# Altium schematic sheet DE-290817_03.SchDoc: Mifare Reader Writer
size A4; Author: eldar6776@hotmail.com; DrawnBy: Eldar Dedić; Organization: I-MEDIA GROUP d.o.o.; Address1: Topal Osman Paše 18; Address2: 71000 Sarajevo; Address3: Federacija BiH; Address4: Bosna i Hercegovina; Revision: 001; DocumentName: DE-290817; ProjectName: Hotel Room Access Controller Unit
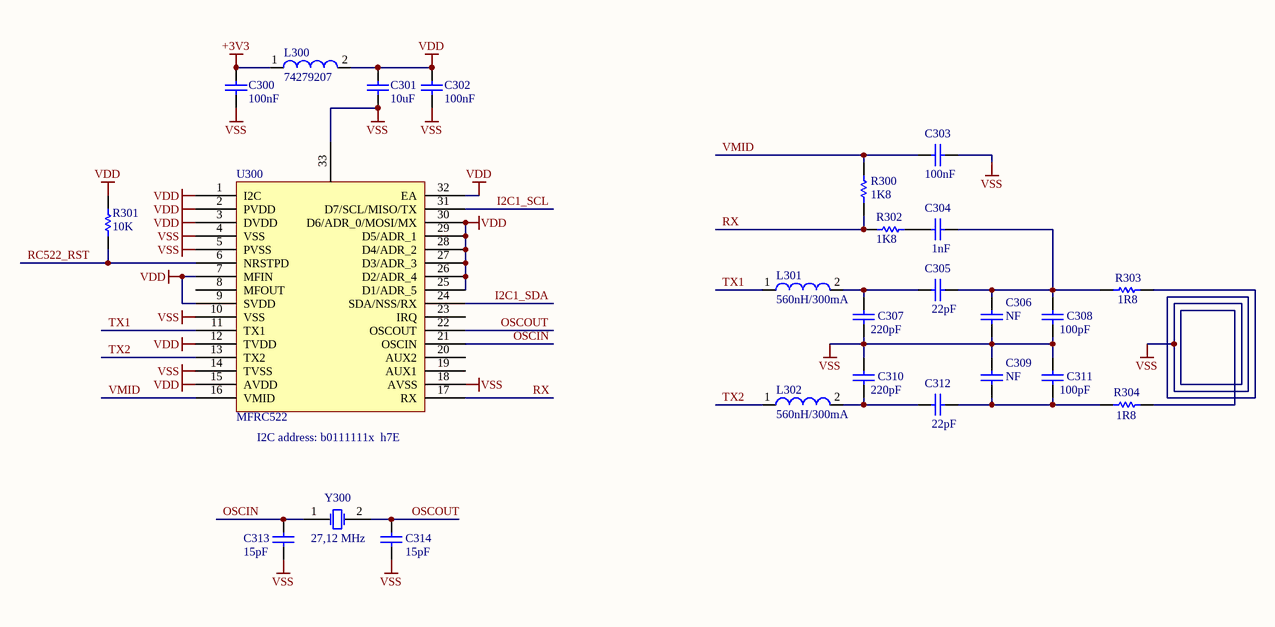
[diagram p0: DE-290817_03.SchDoc]

## Parts
C300  100nF  [0603]
C301  10uF  [0805]
C302  100nF  [0603]
C303  100nF  [0603]
C304  1nF  [0603]
C305  22pF  [0603]
C306  NF  [0603]
C307  220pF  [0603]
C308  100pF  [0603]
C309  NF  [0603]
C310  220pF  [0603]
C311  100pF  [0603]
C312  22pF  [0603]
C313  15pF  [0603]
C314  15pF  [0603]
L300  74279207  [SMD-0805]
L301  560nH/300mA  [SMD-0805]
L302  560nH/300mA  [SMD-0805]
R300  1K8  [3-0603]
R301  10K  [ERA-0603]
R302  1K8  [3-0603]
R303  1R8  [3-0603]
R304  1R8  [3-0603]
U300  MFRC522  [QFN32]
Y300  27,12 MHz  [HC49/4H_SMX]

## Nets
+3V3: C300.2 L300.1
VDD: C301.2 C302.2 L300.2 R301.2 U300.1(I2C) U300.2(PVDD) U300.3(DVDD) U300.7(MFIN) U300.9(SVDD) U300.12(TVDD) U300.15(AVDD) U300.25(D1/ADR_5) U300.26(D2/ADR_4) U300.27(D3/ADR_3) U300.28(D4/ADR_2) U300.29(D5/ADR_1) U300.30(D6/ADR_0/MOSI/MX) U300.32(EA)
VSS: C300.1 C301.1 C302.1 C303.1 C306.1 C307.1 C308.1 C309.2 C310.2 C311.2 C313.1 C314.1 R303.1 R304.1 U300.4(VSS) U300.5(PVSS) U300.10(VSS) U300.14(TVSS) U300.18(AVSS)
I2C1_SCL: U300.31(D7/SCL/MISO/TX)
I2C1_SDA: U300.24(SDA/NSS/RX)
OSCIN: C313.2 U300.21(OSCIN) Y300.1(OSC1)
OSCOUT: C314.2 U300.22(OSCOUT) Y300.2(OSC2)
RC522_RST: R301.1 U300.6(NRSTPD)
RX: R300.2 R302.2 U300.17(RX)
TX1: L301.1 U300.11(TX1)
TX2: L302.1 U300.13(TX2)
VMID: C303.2 R300.1 U300.16(VMID)
NetC304_1: C304.1 C305.1 C306.2 C308.2 R303.2
NetC304_2: C304.2 R302.1
NetC305_2: C305.2 C307.2 L301.2
NetC309_1: C309.1 C311.1 C312.1 R304.2
NetC310_1: C310.1 C312.2 L302.2

Not connected (* = marked no-connect by the designer): U300 8(MFOUT) 19(AUX1) 20(AUX2) 23(IRQ) 33(VSS)

## Notes on the sheet
- (near U300) I2C address: b0111111x  h7E
- Title
- Size:
- Date:
- A4
- Number:
- Time:
- Revision:
- Sheet
- of
- File:

## Library data of the parts
C300 C302-C314 = C0603: Ceramic Chip Capacitor - Standard; Note: Footprint corresponds to dimensions for bulk cassette packaging. This case size has tightened tolerances.; Published: 17-Jul-2002; LatestRevisionDate: 19-Mar-2004; LatestRevisionNote: Silkscreen size reduced.; DatasheetDocument: Mar-2001; PackageDocument: Mar-2001; PackageReference: 0603; Publisher: Altium Limited; Code_JEITA: 0603; Code_IPC: 1608 [0603]; ComponentLink1Description: Manufacturer Link; ComponentLink1URL: http://www.kemet.com/; ComponentLink2Description: Datasheet; ComponentLink2URL: http://www.kemet.com/kemet/web/homepage/kechome.nsf/vapubfilesname/F3102TA.pdf/$file/F3102TA.pdf
  C300 C302 C303: Value: 100nF
  C304: Value: 1nF
  C305 C312: Value: 22pF
  C306 C309: Value: NF
  C307 C310: Value: 220pF
  C308 C311: Value: 100pF
  C313 C314: Value: 15pF
C301 = C0805: Ceramic Chip Capacitor - Standard; Note: Footprint corresponds to dimensions for bulk cassette packaging. This case size has tightened tolerances.; Published: 17-Jul-2002; LatestRevisionDate: 19-Mar-2004; LatestRevisionNote: Silkscreen size reduced.; DatasheetDocument: Mar-2001; PackageDocument: Mar-2001; PackageReference: 0805; Publisher: Altium Limited; Code_JEITA: 0805; Code_IPC: 2012[0805]; ComponentLink1Description: Manufacturer Link; ComponentLink1URL: http://www.kemet.com/; ComponentLink2Description: Datasheet; ComponentLink2URL: http://www.kemet.com/kemet/web/homepage/kechome.nsf/vapubfilesname/F3102TA.pdf/$file/F3102TA.pdf; Value: 10uF
L300 = 74279207: SMD EMI Suppression Ferrite Bead WE-CBF, Z = 100 Ohm; Impedance: 100 Ohm; DatasheetVersion: Dec-2005; PackageReference: SMD-0805; PackageDescription: Chip Inductor, 2-Leads, Body 2.0 x 1.2 mm; PartNumber: 74279207; ComponentLink1Description: Manufacturer URL; ComponentLink1URL: http://www.we-online.com; ComponentLink2Description: Datasheet; ComponentLink2URL: http://www.we-online.de/katalog/media/pdf/74279207.pdf
L301 L302 = 74279207: SMD EMI Suppression Ferrite Bead WE-CBF, Z = 100 Ohm; Impedance: 100 Ohm; Value: 560nH; DatasheetVersion: Dec-2005; PackageReference: SMD-0805; PackageDescription: Chip Inductor, 2-Leads, Body 2.0 x 1.2 mm; PartNumber: 74279207; ComponentLink1Description: Manufacturer URL; ComponentLink1URL: http://www.we-online.com; ComponentLink2Description: Datasheet; ComponentLink2URL: http://www.we-online.de/katalog/media/pdf/74279207.pdf
R300 R302-R304 = ERJ3RS: Low Ohmic Value Thick Film Chip Resistor, 0.1 Ohm to 0.2 Ohm Range, 1%, 2% and 5% Tolerance, 0603 Size, 0.1 W; Published: 17-Dec-2003; LatestRevisionDate: 19-Mar-2004; LatestRevisionNote: Silkscreen size reduced.; PackageDocument: Mar-2003; PackageReference: 3-0603; Publisher: Altium Limited; Code_IPC: 1608 [0603]; ComponentLink1Description: Manufacturer Link; ComponentLink1URL: http://www.panasonic.com/industrial/components/resistive_products.htm; ComponentLink2Description: Datasheet; ComponentLink2URL: http://www.panasonic.com/industrial/components/pdf/AOA0000CE3.pdf
  R300 R302: Value: 1K8
  R303 R304: Value: 1R8
R301 = ERAV: Metal Film Thermosensitive Chip Resistor, 0.56 Ohm to 10k Ohm Range, 5% Tolerance, 0603 Size, 0.063 W; Note: If flow soldering, adjust pad width of PCB Footprint to 0.7 - 0.8 times the width of the resistor.; Published: 17-Dec-2003; LatestRevisionDate: 19-Mar-2004; LatestRevisionNote: Silkscreen size reduced.; PackageDocument: Mar-2003; PackageReference: ERA-0603; Publisher: Altium Limited; Code_IPC: 1608 [0603]; ComponentLink1Description: Manufacturer Link; ComponentLink1URL: http://www.panasonic.com/industrial/components/resistive_products.htm; ComponentLink2Description: Datasheet; ComponentLink2URL: http://www.panasonic.com/industrial/components/pdf/AOF0000CE1.pdf; Value: 10K
U300 = MFRC522: MIFARE reader writer
Y300 = ECS-80-20-1: Crystal Oscillator; Published: 17-Jul-2002; DatasheetDocument: 18-Apr-2000; PackageReference: HC-49U; Publisher: Altium Limited; ComponentLink1Description: Manufacturer Link; ComponentLink1URL: http://www.ecsxtal.com/; ComponentLink2Description: Datasheet; ComponentLink2URL: http://www.ecsxtal.com/pdf2/HC49U.PDF